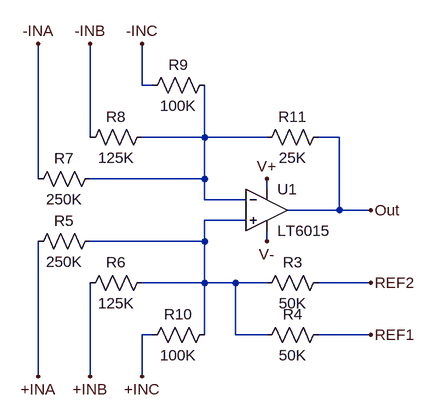
[diagram p0: schematic SpiderAmp.asc]
SpiderAmp.asc, the LTspice schematic file:
Version 4
SHEET 1 968 680
WIRE 528 0 528 -64
WIRE 544 0 528 0
WIRE 448 80 448 -64
WIRE 624 80 624 0
WIRE 624 80 528 80
WIRE 720 80 624 80
WIRE 832 80 800 80
WIRE 368 144 368 -64
WIRE 624 144 624 80
WIRE 624 144 448 144
WIRE 720 160 720 144
WIRE 624 176 624 144
WIRE 688 176 624 176
WIRE 832 192 832 80
WIRE 832 192 752 192
WIRE 880 192 832 192
WIRE 688 208 624 208
WIRE 624 240 624 208
WIRE 624 240 448 240
WIRE 720 240 720 224
WIRE 624 304 624 240
WIRE 624 304 528 304
WIRE 672 304 624 304
WIRE 720 304 672 304
WIRE 880 304 800 304
WIRE 544 384 528 384
WIRE 624 384 624 304
WIRE 672 384 672 304
WIRE 720 384 672 384
WIRE 880 384 800 384
WIRE 368 448 368 240
WIRE 448 448 448 304
WIRE 528 448 528 384
FLAG 720 144 V+
FLAG 720 240 V-
FLAG 880 192 Out
FLAG 880 304 REF2
FLAG 880 384 REF1
FLAG 528 -64 -INC
FLAG 448 -64 -INB
FLAG 368 -64 -INA
FLAG 528 448 +INC
FLAG 448 448 +INB
FLAG 368 448 +INA
SYMBOL Opamps\\LT6015 720 192 R0
SYMATTR InstName U1
SYMBOL res 464 224 R90
WINDOW 0 0 56 VBottom 2
WINDOW 3 32 56 VTop 2
SYMATTR InstName R5
SYMATTR Value 250K
SYMBOL res 544 288 R90
WINDOW 0 0 56 VBottom 2
WINDOW 3 32 56 VTop 2
SYMATTR InstName R6
SYMATTR Value 125K
SYMBOL res 464 128 R90
WINDOW 0 0 56 VBottom 2
WINDOW 3 32 56 VTop 2
SYMATTR InstName R7
SYMATTR Value 250K
SYMBOL res 544 64 R90
WINDOW 0 0 56 VBottom 2
WINDOW 3 32 56 VTop 2
SYMATTR InstName R8
SYMATTR Value 125K
SYMBOL res 640 -16 R90
WINDOW 0 0 56 VBottom 2
WINDOW 3 32 56 VTop 2
SYMATTR InstName R9
SYMATTR Value 100K
SYMBOL res 640 368 R90
WINDOW 0 0 56 VBottom 2
WINDOW 3 32 56 VTop 2
SYMATTR InstName R10
SYMATTR Value 100K
SYMBOL res 816 64 R90
WINDOW 0 0 56 VBottom 2
WINDOW 3 32 56 VTop 2
SYMATTR InstName R11
SYMATTR Value 25K
SYMBOL res 816 288 R90
WINDOW 0 0 56 VBottom 2
WINDOW 3 32 56 VTop 2
SYMATTR InstName R3
SYMATTR Value 50K
SYMBOL res 816 368 R90
WINDOW 0 0 56 VBottom 2
WINDOW 3 32 56 VTop 2
SYMATTR InstName R4
SYMATTR Value 50K

The netlist it stands for:
* SpiderAmp.asc
XU1 N002 N001 V+ V- Out LT6016  ; LT6015, pins In+ In- V+ V- OUT
R5 N002 +INA 250K
R6 N002 +INB 125K
R7 N001 -INA 250K
R8 N001 -INB 125K
R9 N001 -INC 100K
R10 N002 +INC 100K
R11 Out N001 25K
R3 REF2 N002 50K
R4 REF1 N002 50K
.lib LTC2.lib
.backanno
.end